# Altium schematic sheet pikobasic_f3.SchDoc
size A
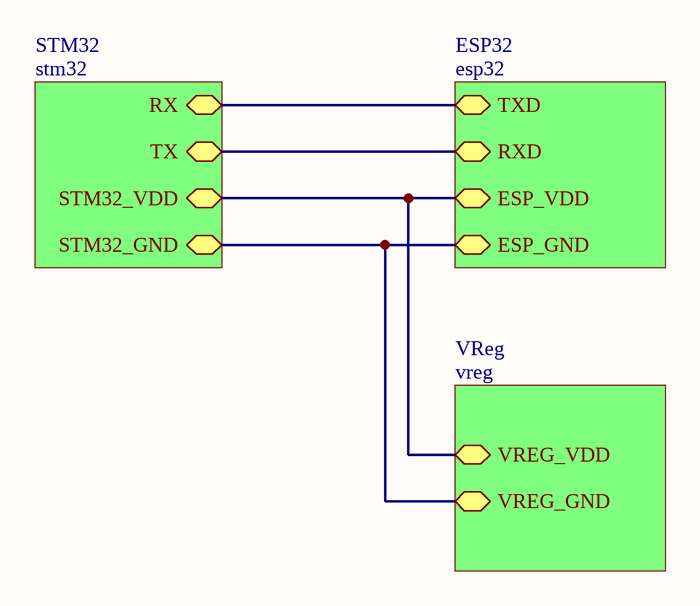
[diagram p0: pikobasic_f3.SchDoc]

## Sub-sheets
ESP32 = esp32: ESP_VDD, ESP_GND, RXD, TXD
STM32 = stm32: TX, RX, STM32_VDD, STM32_GND
VReg = vreg: VREG_VDD, VREG_GND

## Nets
(unnamed): sheet ESP32/ESP_VDD, sheet VReg/VREG_VDD, sheet STM32/STM32_VDD
(unnamed): sheet ESP32/ESP_GND, sheet VReg/VREG_GND, sheet STM32/STM32_GND
(unnamed): sheet ESP32/RXD, sheet STM32/TX
(unnamed): sheet ESP32/TXD, sheet STM32/RX